# EAGLE design untitled (EAGLE 7.2.0)
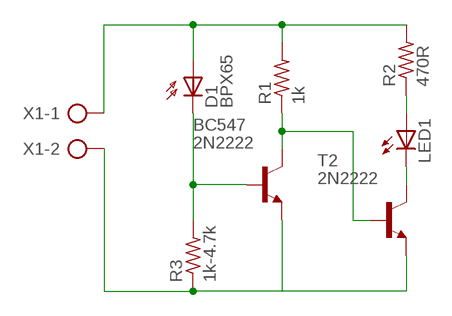
[diagram p0: schematic, sheet 1]

## Parts
BC547  2N2222  [TO92-EBC-OVAL]
D1  BPX65  [BPX65]
LED1  LED3MM  [LED3MM]
R1  1k  R-US_0204/5  [0204/5]
R2  470R  R-US_0204/5  [0204/5]
R3  1k-4.7k  R-US_0204/5  [0204/5]
T2  2N2222  [TO92-EBC-OVAL]
X1  AK500/2  [AK500/2]

## Nets
N$1: D1.A R1.2 R2.2 X1.1
N$2: BC547.B D1.K(C) R3.2
N$3: BC547.C R1.1 T2.B
N$4: BC547.E R3.1 T2.E X1.2
N$5: LED1.A R2.1
N$6: LED1.K(C) T2.C

## Library data of the parts
BC547 T2 = adafruit:2N2222: NPN TRANSISTOR Big oval pads
D1 = opto-trans-siemens:BPX65: PHOTO DIODE; MPN: BPX65.; OC_FARNELL: 327451; OC_NEWARK: 06WX2764
LED1 = adafruit:LED: LED OSRAM: - CHIPLED LG R971, LG N971, LY N971, LG Q971, LY Q971, LO R971, LY R971 LH N974, LH R974 LS Q976, LO Q976, LY Q976 LO Q996 - Hyper CHIPLED LW Q18S LB Q993, LB Q99A, LB R99A - SideLED LS A670, LO A670, LY A670, LG A670, LP A670 LB A673, LV A673, LT A673, LW A673 LH A674 LY A675 LS A676, LA A676, LO A676, LY A676, LW A676 LS A679, LY A679, LG A679 - Hyper Micro SIDELED® LS Y876, LA Y876, LO Y876, LY Y876 LT Y87S - SmartLED LW L88C, LW L88S LB L89C, LB L89S, LG L890 LS L89K, LO L89K, LY L89K LS L896, LA L896, LO L896, LY L896 - TOPLED LS T670, LO T670, LY T670, LG T670, LP T670 LSG T670, LSP T670, LSY T670, LOP T670, LYG T670 LG T671, LOG T671, LSG T671 LB T673, LV T673, LT T673, LW T673 LH T674 LS T676, LA T676, LO T676, LY T676, LB T676, LH T676, LSB T676, LW T676 LB T67C, LV T67C, LT T67C, LS T67K, LO T67K, LY T67K, LW E67C LS E67B, LA E67B, LO E67B, LY E67B, LB E67C, LV E67C, LT E67C LW T67C LS T679, LY T679, LG T679 LS T770, LO T770, LY T770, LG T770, LP T770 LB T773, LV T773, LT T773, LW T773 LH T774 LS E675, LA E675, LY E675, LS T675 LS T776, LA T776, LO T776, LY T776, LB T776 LHGB T686 LT T68C, LB T68C - Hyper Mini TOPLED® LB M676 - Mini TOPLED Santana® LG M470 LS M47K, LO M47K, LY M47K Source: http://www.osram.convergy.de/
R1-R3 = adafruit:R-US_: RESISTOR, American symbol
X1 = con-ptr500:AK500/2: CONNECTOR; OC_FARNELL: unknown; OC_NEWARK: unknown

## Board
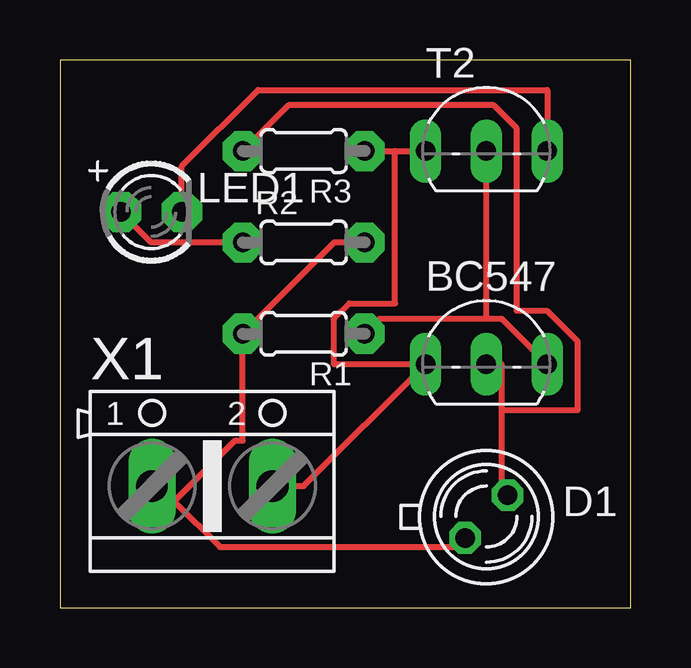
[diagram p1: board, top side]
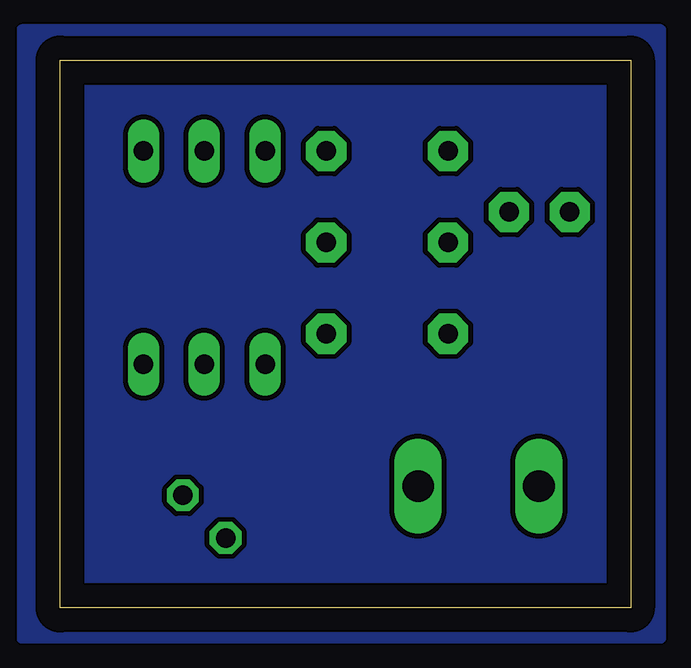
[diagram p2: board, bottom side, seen from below]

Size 23.8 x 22.85 mm. Coordinates in mm from the lower left corner, seen from the top.
Outline: 0,0 23.8,0 23.8,22.85 0,22.85 0,0
Copper layers (1*16): Top 0.035mm / dielectric 1.5mm / Bottom 0.035mm
Design rules "default": minimum track width 10mil, minimum drill 24mil, track to track 8mil, track to pad 8mil, pad to pad 8mil, via to via 8mil, smd to smd 8mil, copper to edge 40mil, drill to drill 8mil, minimum pad ring 10mil, minimum via ring 8mil, stop-mask expansion 4mil, vias tented up to drill 0mil, thermal gap 10mil

### Footprints (pad centres in the part's own frame; a part is rotated, then mirrored left to right if it is on the bottom)
TO92-EBC-OVAL = drill 0.813 long: B 0,-1.27; C 2.54,-1.27; E -2.54,-1.27
BPX65 = drill 0.813 octagon: A -0.889,-0.889; K 0.889,0.889
LED3MM = drill 0.813 pad 1.676 octagon: A -1.27,0; K 1.27,0
0204/5 = drill 0.813 pad 1.676 octagon: 1 -2.54,0; 2 2.54,0
AK500/2 = drill 1.321 long: 1 -2.515,0; 2 2.515,0

### Placement (x,y rotation side)
BC547  17.78,11.43 0 top
D1  17.78,3.81 0 top
LED1  3.81,16.51 0 top
R1  10.16,11.43 180 top
R2  10.16,15.24 0 top
R3  10.16,19.05 180 top
T2  17.78,20.32 0 top
X1  6.35,5.08 0 top

### Tracks (layer width: path | path; a pad name or v marks a point on that pad's centre or on a via)
GND
  pour Bottom: -1.27,24.13 25.4,24.13 25.4,-1.27 -1.27,-1.27
N$1
  Top 0.254: R2.2 11.43,15.24 R1.2 7.62,6.99 7.3,6.99 4.76,4.45 | D1.A 16.51,2.54 6.67,2.54 4.76,4.45 | 4.76,4.45 4.13,5.08 X1.1 4.76,4.45
N$2
  Top 0.254: 18.41,8.26 18.41,10.16 BC547.B | 18.41,8.26 18.41,4.76 D1.K | R3.2 9.53,20.95 18.1,20.95 19.05,20 19.05,12.38 20.32,12.38 21.59,11.11 21.59,8.26 18.41,8.26
N$3
  Top 0.254: BC547.C 18.41,12.06 17.78,12.06 | 17.78,12.06 13.34,12.06 R1.1 | 17.78,12.06 T2.B
N$4
  Top 0.254: R3.1 13.97,19.05 | 13.97,19.05 T2.E | X1.2 10.16,5.08 BC547.E 11.43,10.16 11.43,12.06 12.06,12.7 13.97,12.7 13.97,19.05
N$5
  Top 0.254: LED1.A 3.81,15.24 R2.1
N$6
  Top 0.254: T2.C 20.32,21.59 8.26,21.59 5.08,18.41 LED1.K